# Altium schematic sheet PREAMP0.SchDoc: PREAMP 0
size A3; Date: 2011-11-28; Author: S.Choquette; Revision: 2.0; SheetNumber: 8; SheetTotal: 9
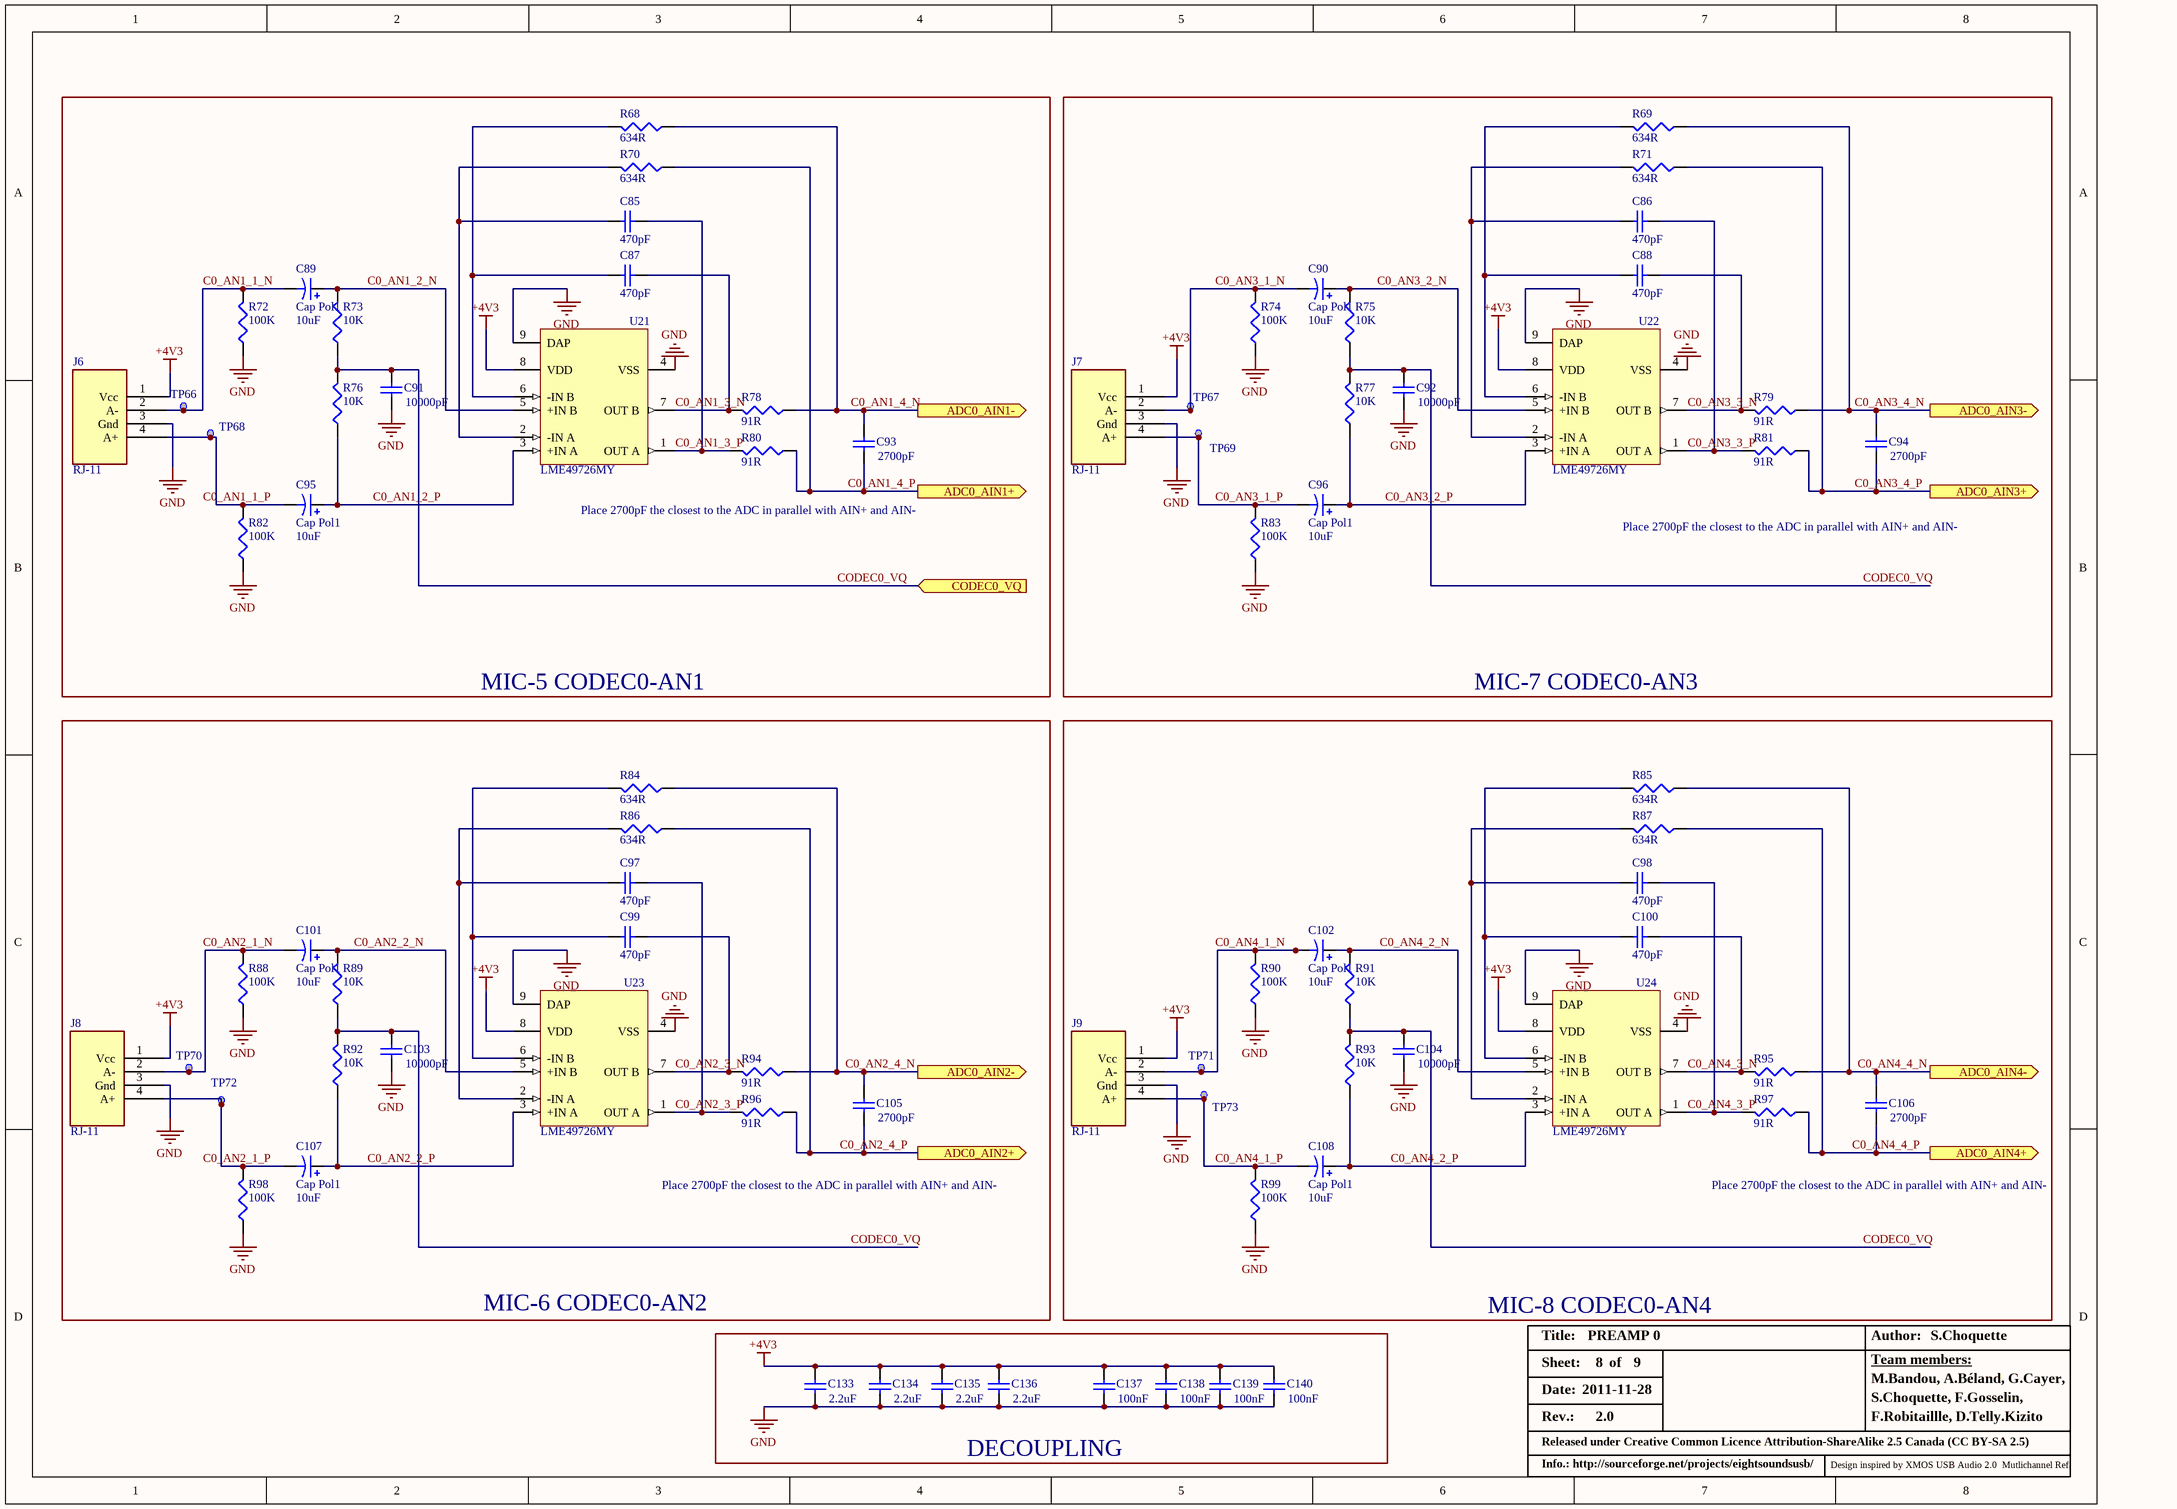
[diagram p0: PREAMP0.SchDoc]

## Parts
C85  value 470pF  [3-0603]
C86  value 470pF  [3-0603]
C87  value 470pF  [3-0603]
C88  value 470pF  [3-0603]
C89  Cap Pol1  value 10uF  [AL_ELEC_SMD_B]
C90  Cap Pol1  value 10uF  [AL_ELEC_SMD_B]
C91  value 10000pF  [2-0402]
C92  value 10000pF  [2-0402]
C93  value 2700pF  [2-0402]
C94  value 2700pF  [2-0402]
C95  Cap Pol1  value 10uF  [AL_ELEC_SMD_B]
C96  Cap Pol1  value 10uF  [AL_ELEC_SMD_B]
C97  value 470pF  [3-0603]
C98  value 470pF  [3-0603]
C99  value 470pF  [3-0603]
C100  value 470pF  [3-0603]
C101  Cap Pol1  value 10uF  [AL_ELEC_SMD_B]
C102  Cap Pol1  value 10uF  [AL_ELEC_SMD_B]
C103  value 10000pF  [2-0402]
C104  value 10000pF  [2-0402]
C105  value 2700pF  [2-0402]
C106  value 2700pF  [2-0402]
C107  Cap Pol1  value 10uF  [AL_ELEC_SMD_B]
C108  Cap Pol1  value 10uF  [AL_ELEC_SMD_B]
C133  value 2.2uF  [8-1206]
C134  value 2.2uF  [8-1206]
C135  value 2.2uF  [8-1206]
C136  value 2.2uF  [8-1206]
C137  value 100nF  [2-0402]
C138  value 100nF  [2-0402]
C139  value 100nF  [2-0402]
C140  value 100nF  [2-0402]
J6  RJ-11  [RJ11]
J7  RJ-11  [RJ11]
J8  RJ-11  [RJ11]
J9  RJ-11  [RJ11]
R68  value 634R  [3-0603]
R69  value 634R  [3-0603]
R70  value 634R  [3-0603]
R71  value 634R  [3-0603]
R72  value 100K  [3-0603]
R73  value 10K  [3-0603]
R74  value 100K  [3-0603]
R75  value 10K  [3-0603]
R76  value 10K  [3-0603]
R77  value 10K  [3-0603]
R78  value 91R  [3-0603]
R79  value 91R  [3-0603]
R80  value 91R  [3-0603]
R81  value 91R  [3-0603]
R82  value 100K  [3-0603]
R83  value 100K  [3-0603]
R84  value 634R  [3-0603]
R85  value 634R  [3-0603]
R86  value 634R  [3-0603]
R87  value 634R  [3-0603]
R88  value 100K  [3-0603]
R89  value 10K  [3-0603]
R90  value 100K  [3-0603]
R91  value 10K  [3-0603]
R92  value 10K  [3-0603]
R93  value 10K  [3-0603]
R94  value 91R  [3-0603]
R95  value 91R  [3-0603]
R96  value 91R  [3-0603]
R97  value 91R  [3-0603]
R98  value 100K  [3-0603]
R99  value 100K  [3-0603]
TP66  TP  [TP]  (value not drawn)
TP67  TP  [TP]  (value not drawn)
TP68  TP  [TP]  (value not drawn)
TP69  TP  [TP]  (value not drawn)
TP70  TP  [TP]  (value not drawn)
TP71  TP  [TP]  (value not drawn)
TP72  TP  [TP]  (value not drawn)
TP73  TP  [TP]  (value not drawn)
U21  LME49726MY  [LME49726]
U22  LME49726MY  [LME49726]
U23  LME49726MY  [LME49726]
U24  LME49726MY  [LME49726]

## Blocks framed on the sheet
MIC-5 CODEC0-AN1: C85 C87 C89 C91 C93 C95 J6 R68 R70 R72 R73 R76 R78 R80 R82 TP66 TP68 U21
MIC-7 CODEC0-AN3: C86 C88 C90 C92 C94 C96 J7 R69 R71 R74 R75 R77 R79 R81 R83 TP67 TP69 U22
MIC-6 CODEC0-AN2: C97 C99 C101 C103 C105 C107 J8 R84 R86 R88 R89 R92 R94 R96 R98 TP70 TP72 U23
MIC-8 CODEC0-AN4: C98 C100 C102 C104 C106 C108 J9 R85 R87 R90 R91 R93 R95 R97 R99 TP71 TP73 U24
DECOUPLING: C133-C140

## Ports
ADC0_AIN1+ (out), ADC0_AIN1- (out), ADC0_AIN2+ (out), ADC0_AIN2- (out), ADC0_AIN3+ (out), ADC0_AIN3- (out), ADC0_AIN4+ (out), ADC0_AIN4- (out), CODEC0_VQ (in)

## Nets
+4V3: C133.2 C134.2 C135.2 C136.2 C137.2 C138.2 C139.2 C140.2 J6.1(Vcc) J7.1(Vcc) J8.1(Vcc) J9.1(Vcc) U21.8(VDD) U22.8(VDD) U23.8(VDD) U24.8(VDD)
GND: C91.1 C92.1 C103.1 C104.1 C133.1 C134.1 C135.1 C136.1 C137.1 C138.1 C139.1 C140.1 J6.3(Gnd) J7.3(Gnd) J8.3(Gnd) J9.3(Gnd) R72.1 R74.1 R82.1 R83.1 R88.1 R90.1 R98.1 R99.1 U21.4(VSS) U21.9(DAP) U22.4(VSS) U22.9(DAP) U23.4(VSS) U23.9(DAP) U24.4(VSS) U24.9(DAP)
C0_AN1_1_N: C89.2 J6.2(A-) R72.2 TP66.1
C0_AN1_2_N: C89.1 R73.2 U21.5(+IN_B)
C0_AN1_2_P: C95.1 R76.1 U21.3(+IN_A)
C0_AN1_3_N: C87.1 R78.2 U21.7(OUT_B)
C0_AN1_3_P: C85.1 R80.2 U21.1(OUT_A)
C0_AN1_4_N: C93.2 R68.1 R78.1 ; port ADC0_AIN1-
C0_AN1_4_P: C93.1 R70.1 R80.1 ; port ADC0_AIN1+
C0_AN2_2_N: C101.1 R89.2 U23.5(+IN_B)
C0_AN2_2_P: C107.1 R92.1 U23.3(+IN_A)
C0_AN2_3_N: C99.1 R94.2 U23.7(OUT_B)
C0_AN2_3_P: C97.1 R96.2 U23.1(OUT_A)
C0_AN2_4_N: C105.2 R84.1 R94.1 ; port ADC0_AIN2-
C0_AN2_4_P: C105.1 R86.1 R96.1 ; port ADC0_AIN2+
C0_AN3_1_N: C90.2 J7.2(A-) R74.2 TP67.1
C0_AN3_1_P: C96.2 J7.4(A+) R83.2 TP69.1
C0_AN3_2_N: C90.1 R75.2 U22.5(+IN_B)
C0_AN3_2_P: C96.1 R77.1 U22.3(+IN_A)
C0_AN3_3_N: C88.1 R79.2 U22.7(OUT_B)
C0_AN3_3_P: C86.1 R81.2 U22.1(OUT_A)
C0_AN3_4_N: C94.2 R69.1 R79.1 ; port ADC0_AIN3-
C0_AN3_4_P: C94.1 R71.1 R81.1 ; port ADC0_AIN3+
C0_AN4_1_P: C108.2 J9.4(A+) R99.2 TP73.1
C0_AN4_2_N: C102.1 R91.2 U24.5(+IN_B)
C0_AN4_2_P: C108.1 R93.1 U24.3(+IN_A)
C0_AN4_3_N: C100.1 R95.2 U24.7(OUT_B)
C0_AN4_3_P: C98.1 R97.2 U24.1(OUT_A)
C0_AN4_4_N: C106.2 R85.1 R95.1 ; port ADC0_AIN4-
C0_AN4_4_P: C106.1 R87.1 R97.1 ; port ADC0_AIN4+
CODEC0_VQ: C91.2 C92.2 C103.2 C104.2 R73.1 R75.1 R76.2 R77.2 R89.1 R91.1 R92.2 R93.2 ; port CODEC0_VQ
NetC85_2: C85.2 R70.2 U21.2(-IN_A)
NetC86_2: C86.2 R71.2 U22.2(-IN_A)
NetC87_2: C87.2 R68.2 U21.6(-IN_B)
NetC88_2: C88.2 R69.2 U22.6(-IN_B)
NetC95_2: C95.2 J6.4(A+) R82.2 TP68.1
NetC97_2: C97.2 R86.2 U23.2(-IN_A)
NetC98_2: C98.2 R87.2 U24.2(-IN_A)
NetC99_2: C99.2 R84.2 U23.6(-IN_B)
NetC100_2: C100.2 R85.2 U24.6(-IN_B)
NetC101_2: C101.2 J8.2(A-) R88.2 TP70.1
NetC102_2: C102.2 J9.2(A-) R90.2 TP71.1
NetC107_2: C107.2 J8.4(A+) R98.2 TP72.1

## Notes on the sheet
- Place 2700pF the closest to the ADC in parallel with AIN+ and AIN-
- Labels drawn without touching a wire or pin: C0_AN1_1_P, C0_AN2_1_N, C0_AN2_1_P, C0_AN4_1_N
- Title:
- Date:
- Sheet:
- of
- Author:
- Team members:
- M.Bandou, A.Béland, G.Cayer,
- Rev.:
- Released under Creative Common Licence Attribution-ShareAlike 2.5 Canada (CC BY-SA 2.5)
- S.Choquette, F.Gosselin,
- F.Robitaillle, D.Telly.Kizito
- Info.: http://sourceforge.net/projects/eightsoundsusb/
- Design inspired by XMOS USB Audio 2.0  Mutlichannel Ref.

## Library data of the parts
C85-C88 C97-C100 = Cap: MLCC 470pF 0603 COG 50V; Manufacturer: Murata; Part Number: GRM1885C1H471JA01D; Cost: 0,005
C89 C90 C95 C96 C101 C102 C107 C108 = Cap Pol1: Al Elec 10uF CaseB 16V; Manufacturer: Panasonic; Part Number: EEEFK1C100R; Cost: *
C91 C92 C103 C104 = Cap: MLCC 10000pF 0402 X7R 25V; Manufacturer: Murata; Part Number: GRM155R71E103KA01D; Cost: 0,005
C93 C94 C105 C106 = Cap: Temperature Compensating 2700pF 0402 COG 10V; Manufacturer: Murata; Part Number: GRM1557U1A272JA01D; Cost: 0,005
C133-C136 = Cap: MLCC 2.2uF 1206 X7R 50V; Manufacturer: Murata; Part Number: GRM31CR71H225KA88L
C137-C140 = Cap: MLCC 100nF 0402 X7R 16V; Manufacturer: Murata; Part Number: GRM155R71C104KA88; Cost: 0,005
J6 J8 J9 = RJ-11: CONN 6-4 MOD JACK; Part Number: SS-6446-NF; Manufacturer: Stewart Connector
J7 = RJ-11: CONN 6-4 MOD JACK; Manufacturer: Stewart Connector; Part Number: SS-6446-NF
R68-R71 R84-R87 = Res3: RES 634R 0603 1%; Manufacturer: ROHM; Part Number: MCR03EZPFX6340; Cost: *
R72 R74 R82 R83 R88 R90 R98 R99 = Res3: RES 100k 0603 1%; Manufacturer: ROHM; Part Number: MCR03EZPFX1003; Cost: *
R73 R75-R77 R89 R91-R93 = Res3: RES 10k 0603 1%; Manufacturer: ROHM; Part Number: MCR03EZPFX1002; Cost: *
R78-R81 R94-R97 = Res3: RES 634R 0603 1%; Manufacturer: ROHM; Part Number: MCR03EZPFX91R0; Cost: *
U21-U24 = LME49726MY: High Current, Low Distortion Rail-to-Rail Output Audio Operational Amplifier; Manufacturer: National Semiconductor; CompType: Audio IC; PackageTopMarking: ZXTT*ZA3; PowerWise: N; Published: 4-Dec-2008; DatasheetVersion: Nov-2008; PackageVersion: revA, Nov-2003; PackageReference: MUY08A; Publisher: Altium Limited; PackageDescription: Molded Mini-SO, Exposed Pad, .118 x .118 x .034in Body, 8 Lead, .0256in Pitch; Part Number: LME49726MY; RoHS: Y; PinCount: 8; Code_JEDEC: MO-187-AA; ComponentLink1Description: LME49726 Datasheet; ComponentLink1URL: http://www.national.com/ds/LM/LME49726.pdf; ComponentLink2Description: LME49726 Web Page; ComponentLink2URL: http://www.national.com/pf/LM/LME49726.html; ComponentLink3Description: MUY08A Package Page; ComponentLink3URL: http://www.national.com/packaging/folders/muy08a.html